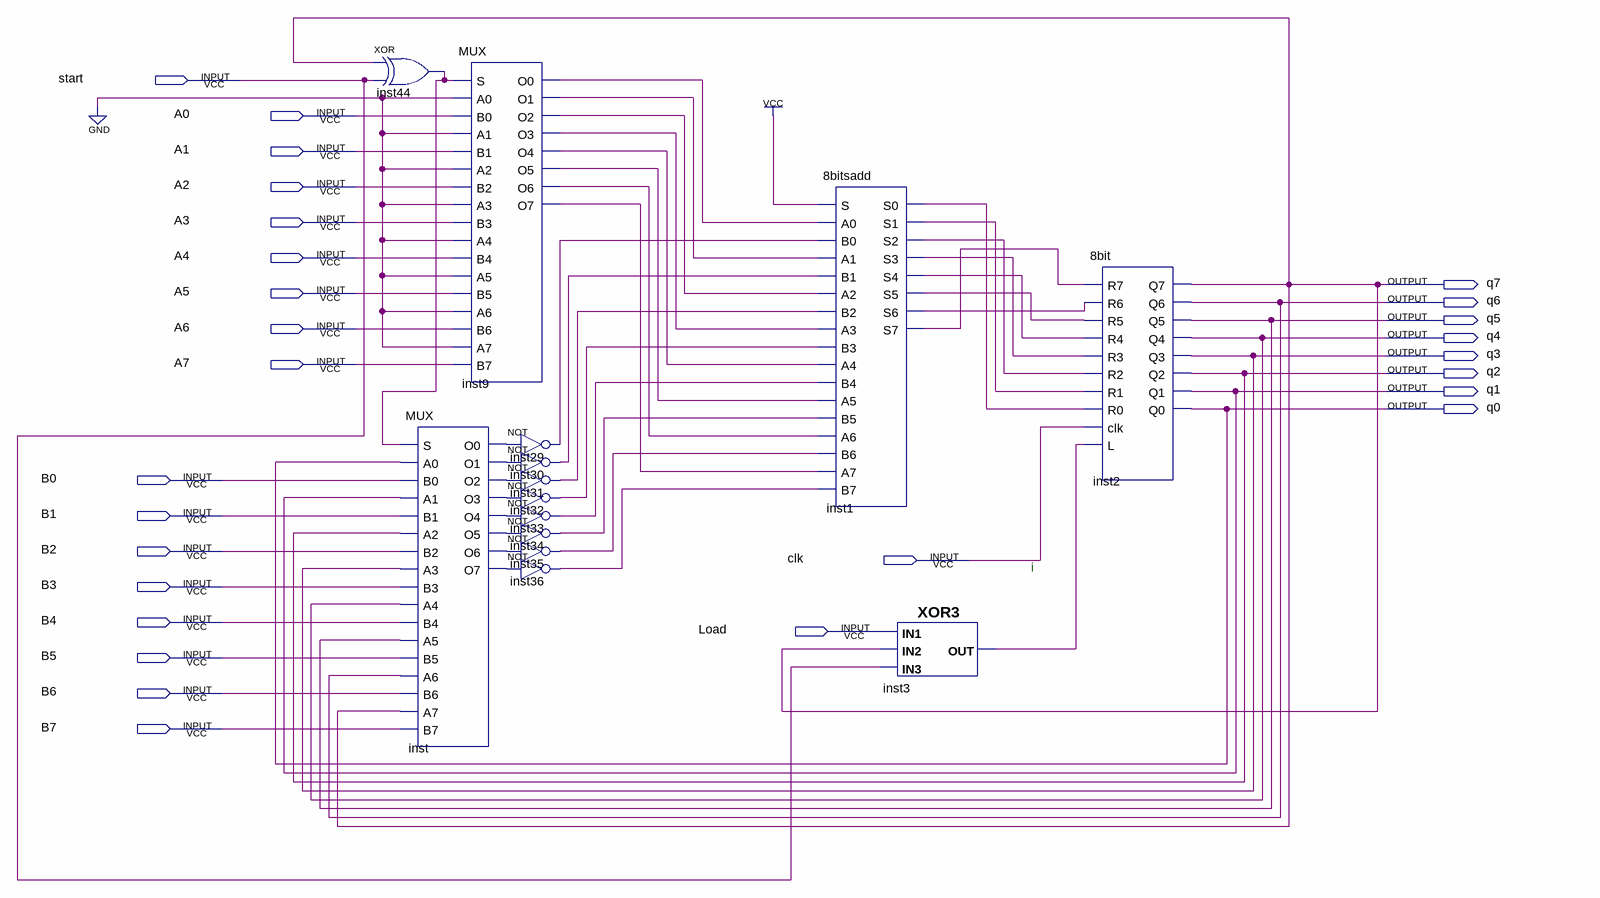
[diagram p0: schematic sheet]
// Quartus schematic rtl.bdf as structural Verilog: 14 symbols, 27 pins
module rtl (
  input  start,
  input  A0,
  input  A1,
  input  A2,
  input  A3,
  input  A4,
  input  A5,
  input  A6,
  input  A7,
  input  B0,
  input  B1,
  input  B2,
  input  clk,
  input  B3,
  input  B4,
  input  Load,
  input  B5,
  input  B6,
  input  B7,
  output q7,
  output q6,
  output q5,
  output q4,
  output q3,
  output q2,
  output q1,
  output q0
);

  wire inst1_s0, inst1_s1, inst1_s2, inst1_s3, inst1_s4, inst1_s5, inst1_s6, inst1_s7, inst3_out, inst9_o0,
       inst9_o1, inst9_o2, inst9_o3, inst9_o4, inst9_o5, inst9_o6, inst9_o7, inst29_out, inst30_out,
       inst31_out, inst32_out, inst33_out, inst34_out, inst35_out, inst36_out, inst44_out, inst_o0, inst_o1,
       inst_o2, inst_o3, inst_o4, inst_o5, inst_o6, inst_o7;

  xor inst44 (inst44_out, q7, start);
  MUX inst (
    .S(inst44_out), .A0(q0), .B0(B0), .A1(q1), .B1(B1), .A2(q2), .B2(B2), .A3(q3), .B3(B3), .A4(q4), .B4(B4),
    .A5(q5), .B5(B5), .A6(q6), .B6(B6), .A7(q7), .B7(B7), .O0(inst_o0), .O1(inst_o1), .O2(inst_o2),
    .O3(inst_o3), .O4(inst_o4), .O5(inst_o5), .O6(inst_o6), .O7(inst_o7));
  MUX inst9 (
    .S(inst44_out), .A0(1'b0), .B0(A0), .A1(1'b0), .B1(A1), .A2(1'b0), .B2(A2), .A3(1'b0), .B3(A3),
    .A4(1'b0), .B4(A4), .A5(1'b0), .B5(A5), .A6(1'b0), .B6(A6), .A7(1'b0), .B7(A7), .O0(inst9_o0),
    .O1(inst9_o1), .O2(inst9_o2), .O3(inst9_o3), .O4(inst9_o4), .O5(inst9_o5), .O6(inst9_o6), .O7(inst9_o7));
  not inst29 (inst29_out, inst_o0);
  not inst30 (inst30_out, inst_o1);
  not inst31 (inst31_out, inst_o2);
  not inst32 (inst32_out, inst_o3);
  not inst33 (inst33_out, inst_o4);
  not inst34 (inst34_out, inst_o5);
  not inst35 (inst35_out, inst_o6);
  not inst36 (inst36_out, inst_o7);
  \8bitsadd  inst1 (
    .S(1'b1), .A0(inst9_o0), .B0(inst29_out), .A1(inst9_o1), .B1(inst30_out), .A2(inst9_o2), .B2(inst31_out),
    .A3(inst9_o3), .B3(inst32_out), .A4(inst9_o4), .B4(inst33_out), .A5(inst9_o5), .B5(inst34_out),
    .A6(inst9_o6), .B6(inst35_out), .A7(inst9_o7), .B7(inst36_out), .S0(inst1_s0), .S1(inst1_s1),
    .S2(inst1_s2), .S3(inst1_s3), .S4(inst1_s4), .S5(inst1_s5), .S6(inst1_s6), .S7(inst1_s7));
  XOR3 inst3 (.IN3(start), .IN1(Load), .IN2(q7), .OUT(inst3_out));
  \8bit  inst2 (
    .R7(inst1_s7), .R6(inst1_s6), .R5(inst1_s5), .R4(inst1_s4), .R3(inst1_s3), .R2(inst1_s2), .R1(inst1_s1),
    .R0(inst1_s0), .clk(clk), .L(inst3_out), .Q7(q7), .Q6(q6), .Q5(q5), .Q4(q4), .Q3(q3), .Q2(q2), .Q1(q1),
    .Q0(q0));

  // Notes on the sheet:
  //   i
endmodule
